# Altium schematic sheet Power Supply.SchDoc
size A4; DrawnBy: Robbie Smedts; Engineer: Robbie Smedts; Organization: Thomas More Campus De Nayer; DocumentNumber: 2; Revision: Rev 0; SheetNumber: 2; SheetTotal: 2; DocumentName: Power Supply; ProjectName: RIAA_CorrectieFilter
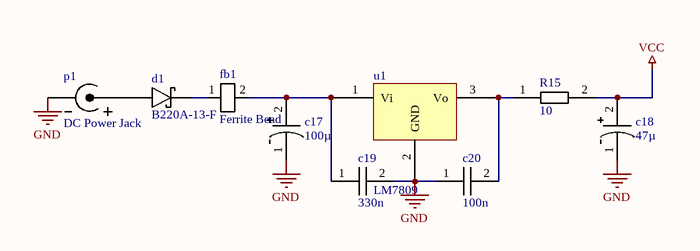
[diagram p0: Power Supply.SchDoc]

## Parts
c17  100µ  [Elco-D]
c18  47µ  [Elco-D]
c19  330n  [0805]
c20  100n  [0805]
d1  B220A-13-F  [SMA]
fb1  Ferrite Bead  [0805]
p1  DC Power Jack  [Power Jack]
R15  10  [1206]
u1  LM7809  [TO-220AB-3]

## Nets
GND: c17.1 c18.1 c19.2 c20.1 p1.2(GND) u1.2(GND)
VCC: c18.2 R15.2
Netc17_2: c17.2 c19.1 fb1.2 u1.1(Vi)
Netc20_2: c20.2 R15.1 u1.3(Vo)
Netd1_1: d1.1(Anode) p1.1(V+)
Netd1_2: d1.2(Kathode) fb1.1

## Library data of the parts
c17 c18 = Elco D: Elco size D 6.3x5.4
c19 c20 = 0805 Capacitor: 0805 Capacitor Package
d1 = B220A-13-F: Schottky Rectifier
fb1 = Ferrite Bead 0805 Package
R15 = 1206 Resistor: Resistor Package 1206
u1 = LM7809: Positive voltage regulator to 9V